# Altium project BLE LED controller.PrjPCB
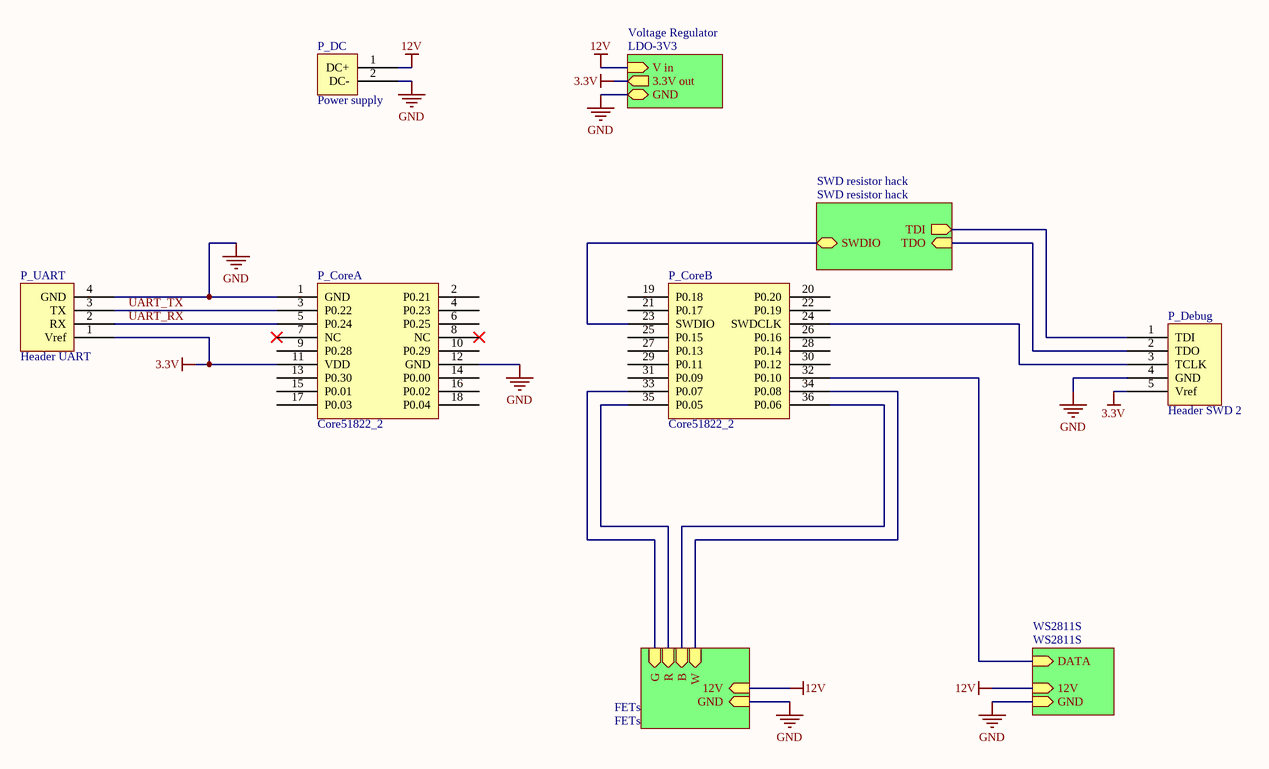
[diagram p0: Top.SchDoc]
3 sheets, 10 parts. Net scope: hierarchical (ports join the sheet entries above them; power ports are global).
Board file: Controller.PcbDoc
Sheets:
  Top.SchDoc
    SWD resistor hack = SWD resistor hack.SchDoc
    WS2811S = WS2811S.SchDoc

## Sheet Top.SchDoc
size A4

### Parts
P_Core  Core51822_2  [Core51822]  (parts A,B of 2)
P_DC  Power supply  [DC cable pad with holes]
P_Debug  Header SWD 2  [Header 1x5 2.54mm]
P_UART  Header UART  [Header 1x4 2.54mm]

### Sub-sheets
FETs = FETs (file not in this document): 12V (in), GND (in), G (in), R (in), B (in), W (in)
SWD resistor hack = SWD resistor hack: SWDIO (bidir), TDI (out), TDO (in)
Voltage Regulator = LDO-3V3 (file not in this document): 3.3V out (out), GND, V in (in)
WS2811S = WS2811S: DATA (in), 12V (in), GND (in)

### Nets
3.3V: P_Core.11(VDD) P_Debug.5(Vref) P_UART.1(Vref) ; sheet Voltage Regulator/3.3V out
12V: P_DC.1(DC+) ; sheet Voltage Regulator/V in, sheet FETs/12V, sheet WS2811S/12V
GND: P_Core.1(GND) P_Core.12(GND) P_DC.2(DC-) P_Debug.4(GND) P_UART.4(GND) ; sheet Voltage Regulator/GND, sheet FETs/GND, sheet WS2811S/GND
UART_RX: P_Core.5(P0.24) P_UART.2(RX)
UART_TX: P_Core.3(P0.22) P_UART.3(TX)
NetP_Core_23: P_Core.23(SWDIO) ; sheet SWD resistor hack/SWDIO
NetP_Core_24: P_Core.24(SWDCLK) P_Debug.3(TCLK)
NetP_Core_32: P_Core.32(P0.10) ; sheet WS2811S/DATA
NetP_Core_33: P_Core.33(P0.07) ; sheet FETs/G
NetP_Core_34: P_Core.34(P0.08) ; sheet FETs/W
NetP_Core_35: P_Core.35(P0.05) ; sheet FETs/R
NetP_Core_36: P_Core.36(P0.06) ; sheet FETs/B
NetP_Debug_1: P_Debug.1(TDI) ; sheet SWD resistor hack/TDI
NetP_Debug_2: P_Debug.2(TDO) ; sheet SWD resistor hack/TDO

Not connected (* = marked no-connect by the designer): P_Core 2(P0.21) 4(P0.23) 6(P0.25) 7(NC)* 8(NC)* 9(P0.28) 10(P0.29) 13(P0.30) 14(P0.00) 15(P0.01) 16(P0.02) 17(P0.03) 18(P0.04) 19(P0.18) 20(P0.20) 21(P0.17) 22(P0.19) 25(P0.15) 26(P0.16) 27(P0.13) 28(P0.14) 29(P0.11) 30(P0.12) 31(P0.09)

## Sheet SWD resistor hack.SchDoc
size A4
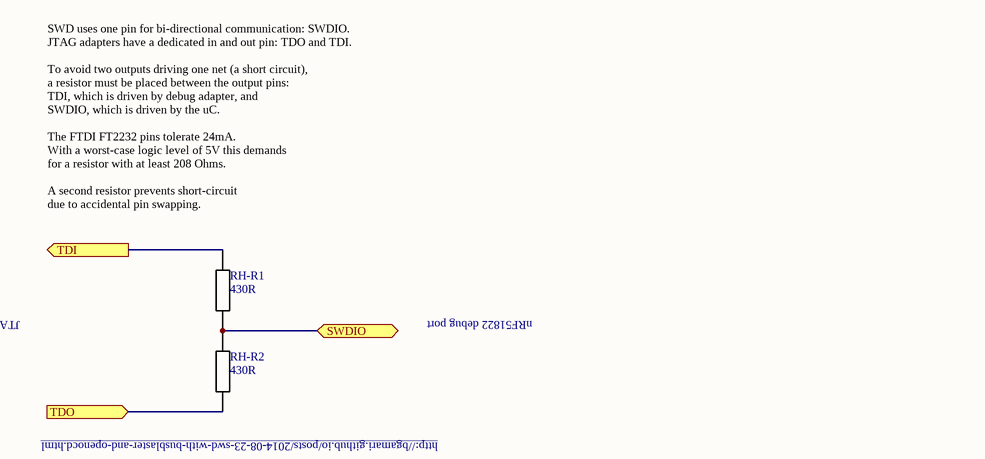
[diagram p1: SWD resistor hack.SchDoc]

### Parts
RH-R1  430R  [R 0805 / 2012]
RH-R2  430R  [R 0805 / 2012]

### Ports
SWDIO, TDI (out), TDO (in)

### Nets
NetP_Core_23: RH-R1.1 RH-R2.2 ; port SWDIO
NetP_Debug_1: RH-R1.2 ; port TDI
NetP_Debug_2: RH-R2.1 ; port TDO

### Notes on the sheet
- (near RH-R1) SWD uses one pin for bi-directional communication: SWDIO.
  JTAG adapters have a dedicated in and out pin: TDO and TDI.
  To avoid two outputs driving one net (a short circuit),
  a resistor must be placed between the output pins:
  TDI, which is driven by debug adapter, and
  SWDIO, which is driven by the uC.
  The FTDI FT2232 pins tolerate 24mA.
  With a worst-case logic level of 5V this demands
  for a resistor with at least 208 Ohms.
  A second resistor prevents short-circuit
  due to accidental pin swapping.
- JTAG/SWD debug adapter
- nRF51822 debug port
- (near RH-R2) http://bgamari.github.io/posts/2014-08-23-swd-with-busblaster-and-openocd.html

### Library data of the parts
RH-R1 RH-R2 = Resistor

## Sheet WS2811S.SchDoc
size A4
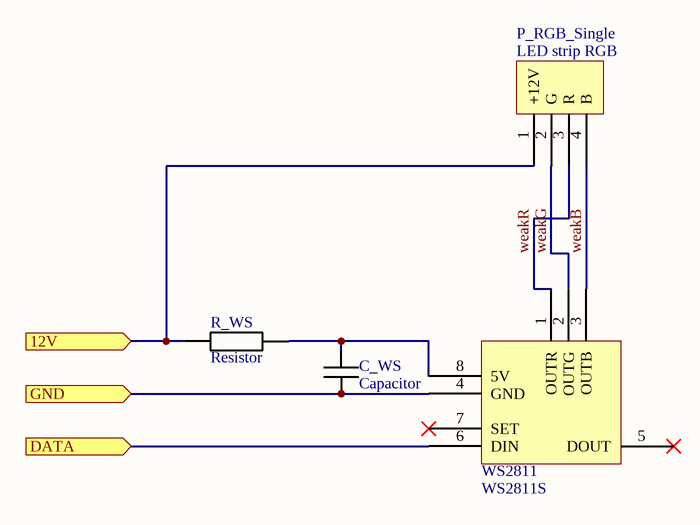
[diagram p2: WS2811S.SchDoc]

### Parts
C_WS  Capacitor  [0805-C]
P_RGB_Single  LED strip RGB  [LED strip RGB connector]
R_WS  Resistor  [0805-C wide]
WS2811  WS2811S  [SOIC-8]

### Ports
12V (in), DATA (in), GND (in)

### Nets
12V: P_RGB_Single.1(+12V) R_WS.1 ; port 12V
GND: C_WS.1 WS2811.4(GND) ; port GND
weakB: P_RGB_Single.4(B) WS2811.3(OUTB)
weakG: P_RGB_Single.2(G) WS2811.2(OUTG)
weakR: P_RGB_Single.3(R) WS2811.1(OUTR)
NetC_WS_2: C_WS.2 R_WS.2 WS2811.8(5V)
NetP_Core_32: WS2811.6(DIN) ; port DATA

Not connected (* = marked no-connect by the designer): WS2811 5(DOUT)* 7(SET)*

### Library data of the parts
WS2811 = WS2811S: RGB LED Controller

## Nets that join several sheets
12V: Top (P_DC.1), WS2811S (P_RGB_Single.1 R_WS.1)
GND: Top (5 pins), WS2811S (C_WS.1 WS2811.4)
NetP_Core_23: Top (P_Core.23), SWD resistor hack (RH-R1.1 RH-R2.2)
NetP_Core_32: Top (P_Core.32), WS2811S (WS2811.6)
NetP_Debug_1: Top (P_Debug.1), SWD resistor hack (RH-R1.2)
NetP_Debug_2: Top (P_Debug.2), SWD resistor hack (RH-R2.1)